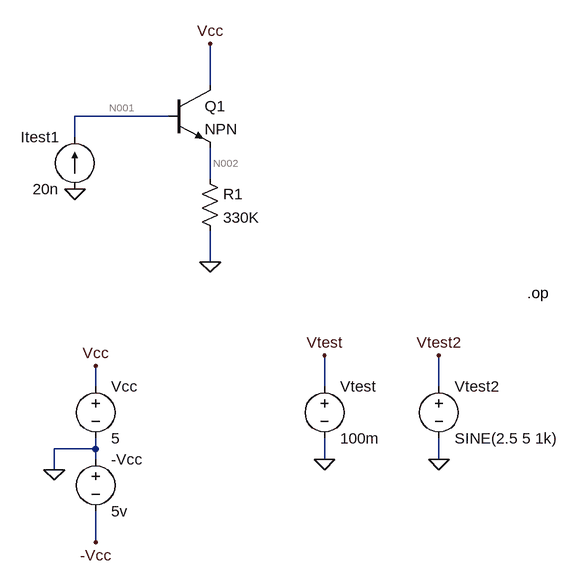
[diagram p0: schematic test_PhotoTransistor.asc]
test_PhotoTransistor.asc, the LTspice schematic file:
Version 4
SHEET 1 1496 680
WIRE 192 -224 192 -288
WIRE 128 -176 -16 -176
WIRE -16 -144 -16 -176
WIRE 192 -80 192 -128
WIRE 192 48 192 0
WIRE 16 240 16 208
WIRE 368 240 368 192
WIRE 544 240 544 192
WIRE 16 336 16 320
WIRE 16 336 -48 336
WIRE 16 352 16 336
WIRE 368 352 368 320
WIRE 544 352 544 320
WIRE -48 368 -48 336
WIRE 16 480 16 432
FLAG 16 208 Vcc
FLAG 16 480 -Vcc
FLAG -48 368 0
FLAG 368 352 0
FLAG 544 352 0
FLAG 368 192 Vtest
FLAG 544 192 Vtest2
FLAG -16 -64 0
FLAG 192 48 0
FLAG 192 -288 Vcc
DATAFLAG 192 -96 ""
SYMBOL voltage 16 224 R0
WINDOW 123 0 0 Left 0
WINDOW 39 0 0 Left 0
SYMATTR InstName Vcc
SYMATTR Value 5
SYMBOL voltage 16 336 R0
WINDOW 123 0 0 Left 0
WINDOW 39 0 0 Left 0
SYMATTR InstName -Vcc
SYMATTR Value 5v
SYMBOL voltage 368 224 R0
WINDOW 123 0 0 Left 0
WINDOW 39 0 0 Left 0
SYMATTR InstName Vtest
SYMATTR Value 100m
SYMBOL voltage 544 224 R0
WINDOW 123 0 0 Left 0
WINDOW 39 0 0 Left 0
SYMATTR InstName Vtest2
SYMATTR Value SINE(2.5 5 1k)
SYMBOL npn 128 -224 R0
SYMATTR InstName Q1
SYMBOL current -16 -64 R180
WINDOW 0 24 80 Left 2
WINDOW 3 24 0 Left 2
WINDOW 123 0 0 Left 0
WINDOW 39 0 0 Left 0
SYMATTR InstName Itest1
SYMATTR Value 20n
SYMBOL res 176 -96 R0
SYMATTR InstName R1
SYMATTR Value 330K
TEXT 680 96 Left 2 !.op

The netlist it stands for:
* test_PhotoTransistor.asc
Vcc Vcc 0 5
V§-Vcc 0 -Vcc 5v
Vtest Vtest 0 100m
Vtest2 Vtest2 0 SINE(2.5 5 1k)
Q1 Vcc N001 N002 0 NPN
Itest1 0 N001 20n
R1 N002 0 330K
.model NPN NPN
.model PNP PNP
.lib standard.bjt
.op
.backanno
.end

* Results of the author's LTspice run, read from the files saved beside the schematic
* Operating Point:
*   V(vcc) = 5 V
*   V(-vcc) = -5 V
*   V(vtest) = 100 mV
*   V(vtest2) = 2.5 V
*   V(n001) = 1.28 V
*   V(n002) = 666.7 mV
*   Ic(Q1) = 2 µA
*   Ib(Q1) = 20 nA
*   Ie(Q1) = -2.02 µA
*   I(Itest1) = 20 nA
*   I(R1) = 2.02 µA
*   I(Vtest2) = 0 A
*   I(Vtest) = 0 A
*   I(-vcc) = 0 A
*   I(Vcc) = -2 µA
* From the log:
*   Semiconductor Device Operating Points:
*                           --- Bipolar Transistors ---
*   Name:       q1
*   Model:      npn
*   Ib:       2.00e-08
*   Ic:       2.00e-06
*   Vbe:      6.13e-01
*   Vbc:     -3.72e+00
*   Vce:      4.33e+00
*   BetaDC:   1.00e+02
*   Gm:       7.73e-05
*   Rpi:      1.29e+06
*   Rx:       0.00e+00
*   Ro:       7.44e+76
*   Cbe:      0.00e+00
*   Cbc:      0.00e+00
*   Cjs:      0.00e+00
*   BetaAC:   1.00e+02
*   Cbx:      0.00e+00
*   Ft:       0.00e+00